# Altium schematic sheet 243-436_Manette-ESP32.SchDoc: =NomDeProjet
size Letter; ApprovedBy: APPROUVÉ PAR; Engineer: K.Cotton; Organization: Cegep Limoilou; Address1: 1300, 8e Avenue; Address2: Québec, QC; Address3: Canada; Address4: G1J 5L5; SheetNumber: 1; SheetTotal: 4
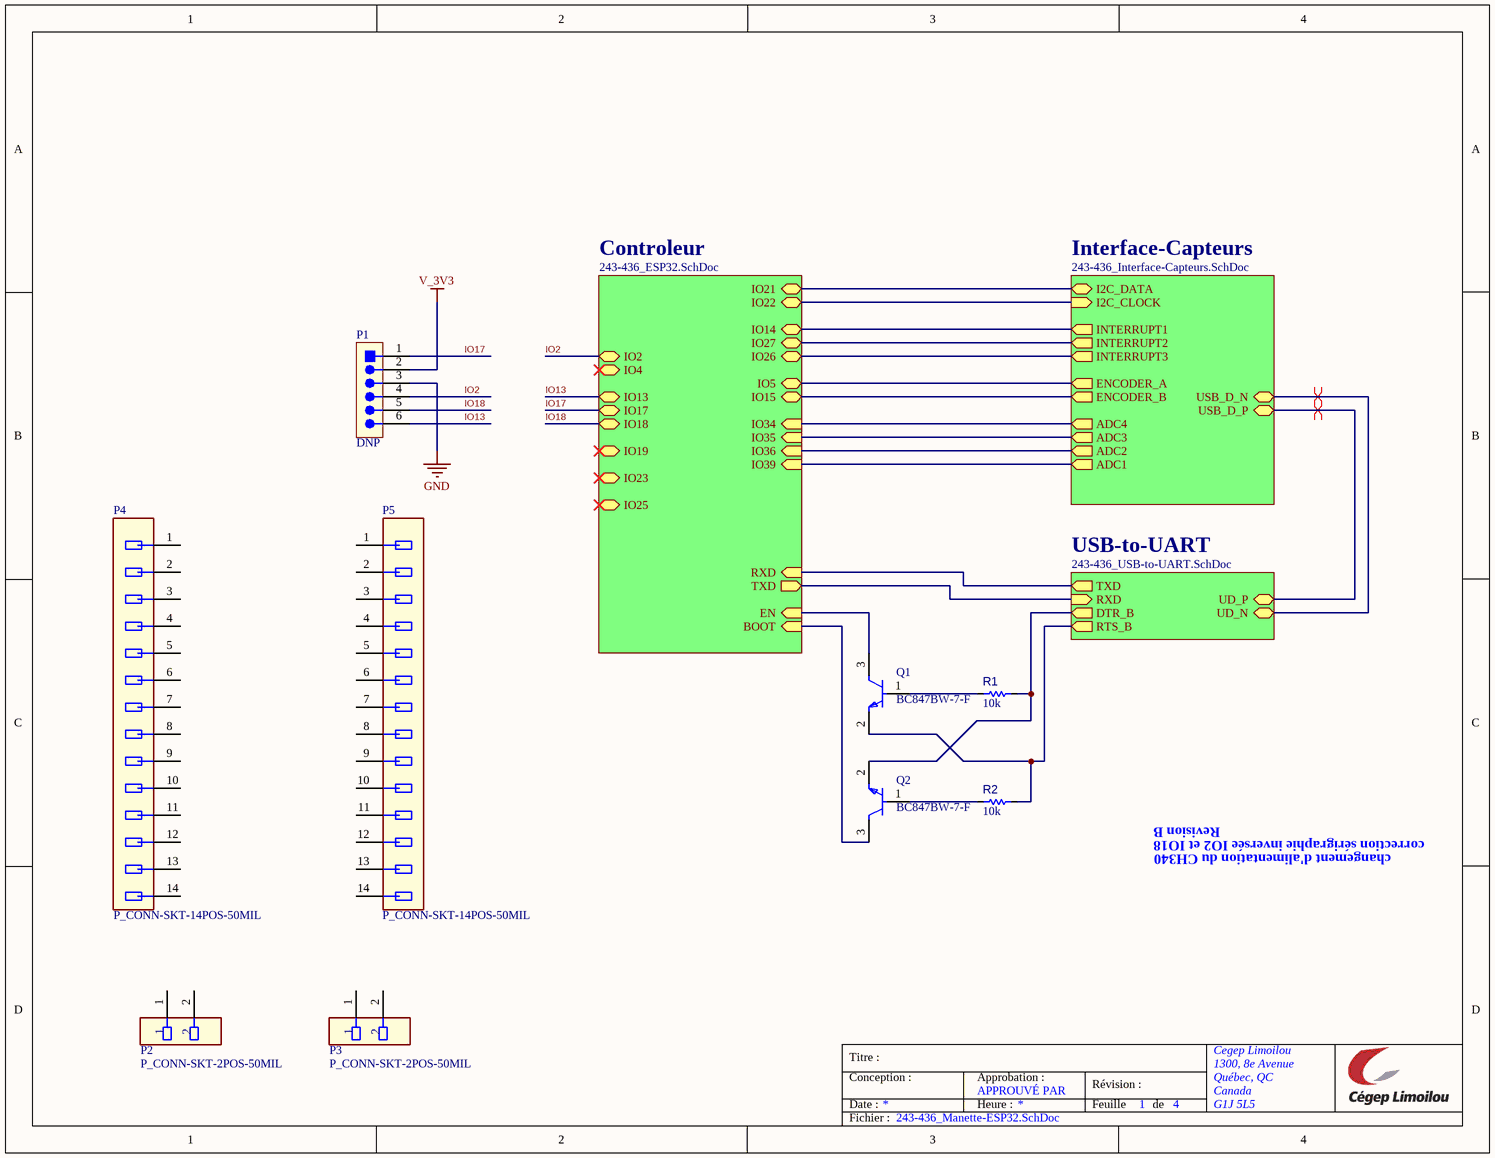
[diagram p0: 243-436_Manette-ESP32.SchDoc]

## Parts
P1  DNP  [P_CONN_HDR_1ROW_6POS_100MIL]  (no BOM)
P2  P_CONN-SKT-2POS-50MIL  [P_CONN_SKT_1ROW_2POS_50MIL]
P3  P_CONN-SKT-2POS-50MIL  [P_CONN_SKT_1ROW_2POS_50MIL]
P4  P_CONN-SKT-14POS-50MIL  [P_CONN_SKT_1ROW_14POS_50MIL]
P5  P_CONN-SKT-14POS-50MIL  [P_CONN_SKT_1ROW_14POS_50MIL]
Q1  BC847BW-7-F  [SOT323-IPC_B]
Q2  BC847BW-7-F  [SOT323-IPC_B]
R1  value 10k  [R_1005[0402]]  (hidden comment: Res 10k 1% 0402)
R2  value 10k  [R_1005[0402]]  (hidden comment: Res 10k 1% 0402)

## Sub-sheets
Controleur = 243-436_ESP32.SchDoc: IO34 (in), IO35 (in), IO25 (bidir), IO26 (bidir), IO27 (bidir), IO14 (bidir), IO13 (bidir), IO15 (bidir), TXD (out), RXD (in), IO23 (bidir), IO22 (bidir), IO19 (bidir), IO18 (bidir), IO5 (bidir), IO17 (bidir), IO4 (bidir), IO2 (bidir), IO21 (bidir), IO36 (in), IO39 (in), EN (in), BOOT (in)
Interface-Capteurs = 243-436_Interface-Capteurs.SchDoc: USB_D_N (bidir), USB_D_P (bidir), INTERRUPT1 (out), INTERRUPT2 (out), INTERRUPT3 (out), ENCODER_B (out), ENCODER_A (out), I2C_DATA (bidir), I2C_CLOCK (in), ADC4 (out), ADC3 (out), ADC2 (out), ADC1 (out)
USB-to-UART = 243-436_USB-to-UART.SchDoc: RXD (in), TXD (out), UD_P (bidir), UD_N (bidir), RTS_B (out), DTR_B (out)

## Nets
GND: P1.3
V_3V3: P1.2
IO2: P1.4 ; sheet Controleur/IO2
IO13: P1.6 ; sheet Controleur/IO13
IO17: P1.1 ; sheet Controleur/IO17
IO18: P1.5 ; sheet Controleur/IO18
NetQ1_1: Q1.1(B) R1.2
NetQ1_2: Q1.2(E) R2.1 ; sheet USB-to-UART/RTS_B
NetQ1_3: Q1.3(C) ; sheet Controleur/EN
NetQ2_1: Q2.1(B) R2.2
NetQ2_2: Q2.2(E) R1.1 ; sheet USB-to-UART/DTR_B
NetQ2_3: Q2.3(C) ; sheet Controleur/BOOT
(unnamed): sheet Controleur/IO34, sheet Interface-Capteurs/ADC4
(unnamed): sheet Controleur/IO35, sheet Interface-Capteurs/ADC3
(unnamed): sheet Controleur/IO26, sheet Interface-Capteurs/INTERRUPT3
(unnamed): sheet Controleur/IO27, sheet Interface-Capteurs/INTERRUPT2
(unnamed): sheet Controleur/IO14, sheet Interface-Capteurs/INTERRUPT1
(unnamed): sheet Controleur/IO15, sheet Interface-Capteurs/ENCODER_B
(unnamed): sheet Controleur/TXD, sheet USB-to-UART/RXD
(unnamed): sheet Controleur/RXD, sheet USB-to-UART/TXD
(unnamed): sheet Controleur/IO22, sheet Interface-Capteurs/I2C_CLOCK
(unnamed): sheet Controleur/IO5, sheet Interface-Capteurs/ENCODER_A
(unnamed): sheet Controleur/IO21, sheet Interface-Capteurs/I2C_DATA
(unnamed): sheet Controleur/IO36, sheet Interface-Capteurs/ADC2
(unnamed): sheet Controleur/IO39, sheet Interface-Capteurs/ADC1
(unnamed): sheet Interface-Capteurs/USB_D_N, sheet USB-to-UART/UD_N
(unnamed): sheet Interface-Capteurs/USB_D_P, sheet USB-to-UART/UD_P

Not connected (* = marked no-connect by the designer): P2 1 2; P3 1 2; P4 1 2 3 4 5 6 7 8 9 10 11 12 13 14; P5 1 2 3 4 5 6 7 8 9 10 11 12 13 14

## Layout directives
differential pair: (no net found under the mark)

## Notes on the sheet
- Revision B
- correction sérigraphie inversée IO2 et IO18
- changement d'alimentation du CH340
- Titre :
- Conception :
- Date :
- Approbation :
- Heure :
- Révision :
- Feuille
- de
- Fichier :

## Library data of the parts
P1 = P_Conn_01x06_100mils: Conn. Header 6pos 100mils; Mounting Technology: Through-hole
P2 P3 = P_CONN-SKT-2POS-50MIL: CONN SOCKET 2POS 1.27mm SINGLE ROW TH; Manufacturer 1: Megastar; Manufacturer Part Number 1: ZX-PM1.27-1-2PU-Z; Mounting Technology: Through-hole; Supplier 1: LCSC; Supplier Part Number 1: C41370629; Manufacturer 2: Sullins
P4 P5 = P_CONN-SKT-14POS-50MIL: CONN SOCKET 14POS 1.27mm SINGLE ROW TH; Manufacturer 1: Megastar; Manufacturer Part Number 1: ZX-PM1.27-1-14PU-Z; Mounting Technology: Through-hole; Supplier 1: LCSC; Supplier Part Number 1: C41370641; Manufacturer 2: Sullins
Q1 Q2 = Q_BC847BW: TRANS NPN 45V 0.1A SC70-3; Manufacturer 1: Diodes Inc; Manufacturer Part Number 1: BC847BW-7-F
R1 R2 = RES003: Resistor type 1; Manufacturer 1: Yageo; Manufacturer Part Number 1: RC0402FR-0710KL; LibRef: RES003; Puissance: 1/16W; Max Working Voltage: 50V; Tolerance: 1%; Mounting Technology: SMT; Supplier 1: LCSC; Supplier Part Number 1: C60490